# Altium schematic sheet USB-C.SchDoc
size B; DocumentFullName: Connectors and Power; Organization: Reclaimer Labs, LLC; Address1: 3652 Beth Ct; Address2: Santa Clara CA 95054; DocumentNumber: 1; SheetNumber: 1; SheetTotal: 3; License: Open Source Hardware - MIT License
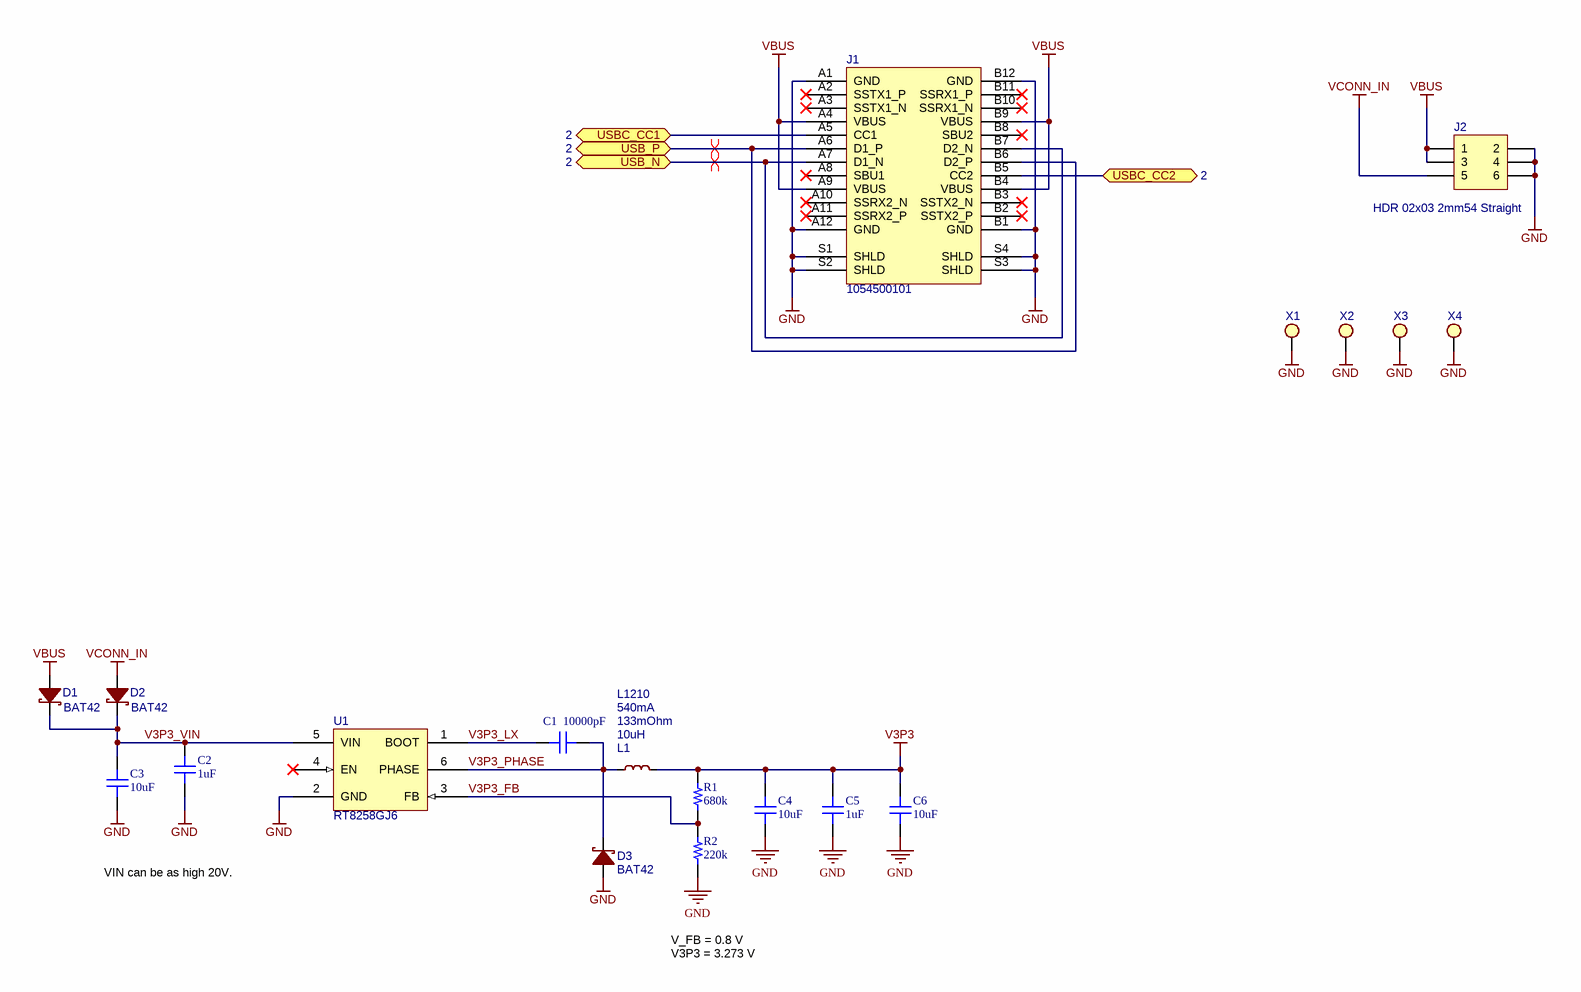
[diagram p0: USB-C.SchDoc]

## Parts
C1  10000pF  [CAP 0402/1005]
C2  1uF  [CAP 0603/1608]
C3  10uF  [CAP 0805/2012]
C4  10uF  [CAP 0805/2012]
C5  1uF  [CAP 0603/1608]
C6  10uF  [CAP 0805/2012]
D1  value BAT42  [SOD-123]  (hidden comment: MF-DIO-SOD123-BAT42)
D2  value BAT42  [SOD-123]  (hidden comment: MF-DIO-SOD123-BAT42)
D3  value BAT42  [SOD-123]  (hidden comment: MF-DIO-SOD123-BAT42)
J1  1054500101  [1054500101]
J2  value HDR 02x03 2mm54 Straight  [CONN_HEADER_02x03_2mm54_Straight]  (hidden comment: MF-CON-2.54mm-2x3)
L1  value 10uH  DCR: 133mOhm  Current: 540mA  [L1210]  (hidden comment: MF-IND-1210-10uH)
R1  680k  [RES 0402/1005]
R2  220k  [RES 0402/1005]
U1  RT8258GJ6  [SOT23-6]
X1  MTHOLE  (value not drawn)  (no BOM)
X2  MTHOLE  (value not drawn)  (no BOM)
X3  MTHOLE  (value not drawn)  (no BOM)
X4  MTHOLE  (value not drawn)  (no BOM)

## Ports
USB_N (bidir, see 2), USB_P (bidir, see 2), USBC_CC1 (bidir, see 2), USBC_CC2 (bidir, see 2)

## Nets
GND: C2.2 C3.1 C4.1 C5.2 C6.1 D3.2(C2) J1.A1(GND) J1.A12(GND) J1.B1(GND) J1.B12(GND) J1.S1(SHLD) J1.S2(SHLD) J1.S3(SHLD) J1.S4(SHLD) J2.2 J2.4 J2.6 R2.1 U1.2(GND) X1.1 X2.1 X3.1 X4.1
V3P3: C4.2 C5.1 C6.2 L1.2(R2) R1.2
VBUS: D1.2(C2) J1.A4(VBUS) J1.A9(VBUS) J1.B4(VBUS) J1.B9(VBUS) J2.1 J2.3
VCONN_IN: D2.2(C2) J2.5
USB_N: J1.A7(D1_N) J1.B7(D2_N) ; port USB_N
USB_P: J1.A6(D1_P) J1.B6(D2_P) ; port USB_P
USBC_CC1: J1.A5(CC1) ; port USBC_CC1
USBC_CC2: J1.B5(CC2) ; port USBC_CC2
V3P3_FB: R1.1 R2.2 U1.3(FB)
V3P3_LX: C1.1 U1.1(BOOT)
V3P3_PHASE: C1.2 D3.1(C1) L1.1(R1) U1.6(PHASE)
V3P3_VIN: C2.1 C3.2 D1.1(C1) D2.1(C1) U1.5(VIN)

Not connected (* = marked no-connect by the designer): J1 A2(SSTX1_P)* A3(SSTX1_N)* A8(SBU1)* A10(SSRX2_N)* A11(SSRX2_P)* B2(SSTX2_P)* B3(SSTX2_N)* B8(SBU2)* B10(SSRX1_N)* B11(SSRX1_P)*; U1 4(EN)*

## Layout directives
differential pair: USB_N, USB_P

## Notes on the sheet
- VIN can be as high 20V.
- V_FB = 0.8 V
  V3P3 = 3.273 V
- Project:
- Date:
- Revision:
- Drawn By:
- Document:
- Time:
- Sheet
- of

## Library data of the parts
C1 = GCM155R71H103KA55D: CAP CER 10000PF 50V X7R 0402; Manufacturer: Murata Electronics North America; TemperatureRange: -55C ~ 125C; Tolerance: 10%; Value: 10000pF; Part Number: GCM155R71H103KA55D; PartId: 12381; Supplier 1: Digi-Key; Supplier Part Number 1: 490-4762-2-ND; ComponentLink1Description: Datasheet; ComponentLink1URL: http://www.murata.com/~/media/webrenewal/support/library/catalog/products/capacitor/mlcc/c03e.ashx; ComponentLink2Description: Digi-Key Listing; ComponentLink2URL: https://www.digikey.com/product-detail/en/murata-electronics-north-america/GCM155R71H103KA55D/490-4762-2-ND/1641636; TemperatureCoefficient: X7R; Voltage: 50V; Price: 0,0067; Device Package: 0402 (1005 Metric)
C2 C5 = GRM188R7YA105KA12D: CAP CER 1UF 35V X7R 0603; Manufacturer: Murata Electronics North America; TemperatureRange: -55C ~ 125C; Tolerance: 10%; Type: Derating Recommended; Value: 1uF; Part Number: GRM188R7YA105KA12D; PartId: 5658; Supplier 1: Digi-Key; Supplier Part Number 1: 490-10487-2-ND; ComponentLink1Description: Datasheet; ComponentLink1URL: http://www.murata.com/~/media/webrenewal/support/library/catalog/products/capacitor/mlcc/c02e.ashx; ComponentLink2Description: Digi-Key listing; ComponentLink2URL: http://digikey.com/product-detail/en/GRM188R7YA105KA12D/490-10487-2-ND/5027572; TemperatureCoefficient: X7R; Voltage: 35V; Price: 0,0735; Device Package: 0603 (1608 Metric)
C3 C4 C6 = C2012X5R1V106M085AC: CAP CER 10UF 35V X5R 0805; Manufacturer: TDK Corporation; TemperatureRange: -55C ~ 85C; Tolerance: 20%; Value: 10uF; Part Number: C2012X5R1V106M085AC; PartId: 4768; Supplier 1: Digi-Key; Supplier Part Number 1: 445-14419-2-ND; ComponentLink1Description: Datasheet; ComponentLink1URL: https://product.tdk.com/info/en/catalog/datasheets/mlcc_commercial_general_en.pdf; ComponentLink2Description: Digi-Key listing; ComponentLink2URL: http://digikey.com/product-detail/en/C2012X5R1V106M085AC/445-14419-2-ND/3951655; TemperatureCoefficient: X5R; Voltage: 35V; Price: 0,2152; Type: -; Device Package: 0805 (2012 Metric)
D1 D2 = DIODE_SCHOTTKY: Manufacturer: MacroFab; Manufacturer Part Number 1: MF-DIO-SOD123-BAT42
D3 = DIODE_SCHOTTKY: Manufacturer 1: MacroFab; Manufacturer Part Number 1: MF-DIO-SOD123-BAT42
J1 = USB-C_RECPT: Manufacturer: Molex; Value: 1054500101; Manufacturer Part Number 1: 1054500101
J2 = CONN_HEADER_02x03_2mm54_Straight: Manufacturer 1: MacroFab; Manufacturer Part Number 1: MF-CON-2.54mm-2x3
L1 = INDUCTOR: Manufacturer 1: MacroFab; FootprintDisplay: L1210; Manufacturer Part Number 1: MF-IND-1210-10uH
R1 = ERJ-2GEJ684X: RES SMD 680K OHM 5% 1/10W 0402; Manufacturer: Panasonic Electronic Components; TemperatureRange: -55C ~ 155C; TemperatureCoefficient: 200ppm/C; PowerRating: 0.1W, 1/10W; Value: 680k; Part Number: ERJ-2GEJ684X; PartId: 11069; Supplier 1: Digi-Key; Supplier Part Number 1: P680KJTR-ND; ComponentLink1Description: Datasheet; ComponentLink1URL: http://industrial.panasonic.com/www-cgi/jvcr13pz.cgi?E+PZ+3+AOA0001+ERJ2GEJ684X+7+WW; ComponentLink2Description: Digi-Key Listing; ComponentLink2URL: https://www.digikey.com/product-detail/en/panasonic-electronic-components/ERJ-2GEJ684X/P680KJTR-ND/147058; Tolerance: 5%; Price: 0,0019; Device Package: 0402 (1005 Metric)
R2 = ERJ-2GEJ224X: RES SMD 220K OHM 5% 1/10W 0402; Manufacturer: Panasonic Electronic Components; TemperatureRange: -55C ~ 155C; TemperatureCoefficient: 200ppm/C; PowerRating: 0.1W, 1/10W; Value: 220k; Part Number: ERJ-2GEJ224X; PartId: 11020; Supplier 1: Digi-Key; Supplier Part Number 1: P220KJTR-ND; ComponentLink1Description: Datasheet; ComponentLink1URL: http://industrial.panasonic.com/www-cgi/jvcr13pz.cgi?E+PZ+3+AOA0001+ERJ2GEJ224X+7+WW; ComponentLink2Description: Digi-Key Listing; ComponentLink2URL: https://www.digikey.com/product-detail/en/panasonic-electronic-components/ERJ-2GEJ224X/P220KJTR-ND/146936; Tolerance: 5%; Price: 0,0019; Device Package: 0402 (1005 Metric)
U1 = BUCK_RT8258GJ6: Manufacturer 1: Richtek; Value: RT8258GJ6; Supplier 1: Digi-Key; Supplier Part Number 1: 1028-1044-1-ND; Manufacturer Part Number 1: RT8258GJ6